# EAGLE design BMS_Slave_V2.0 (EAGLE 6.5.0)
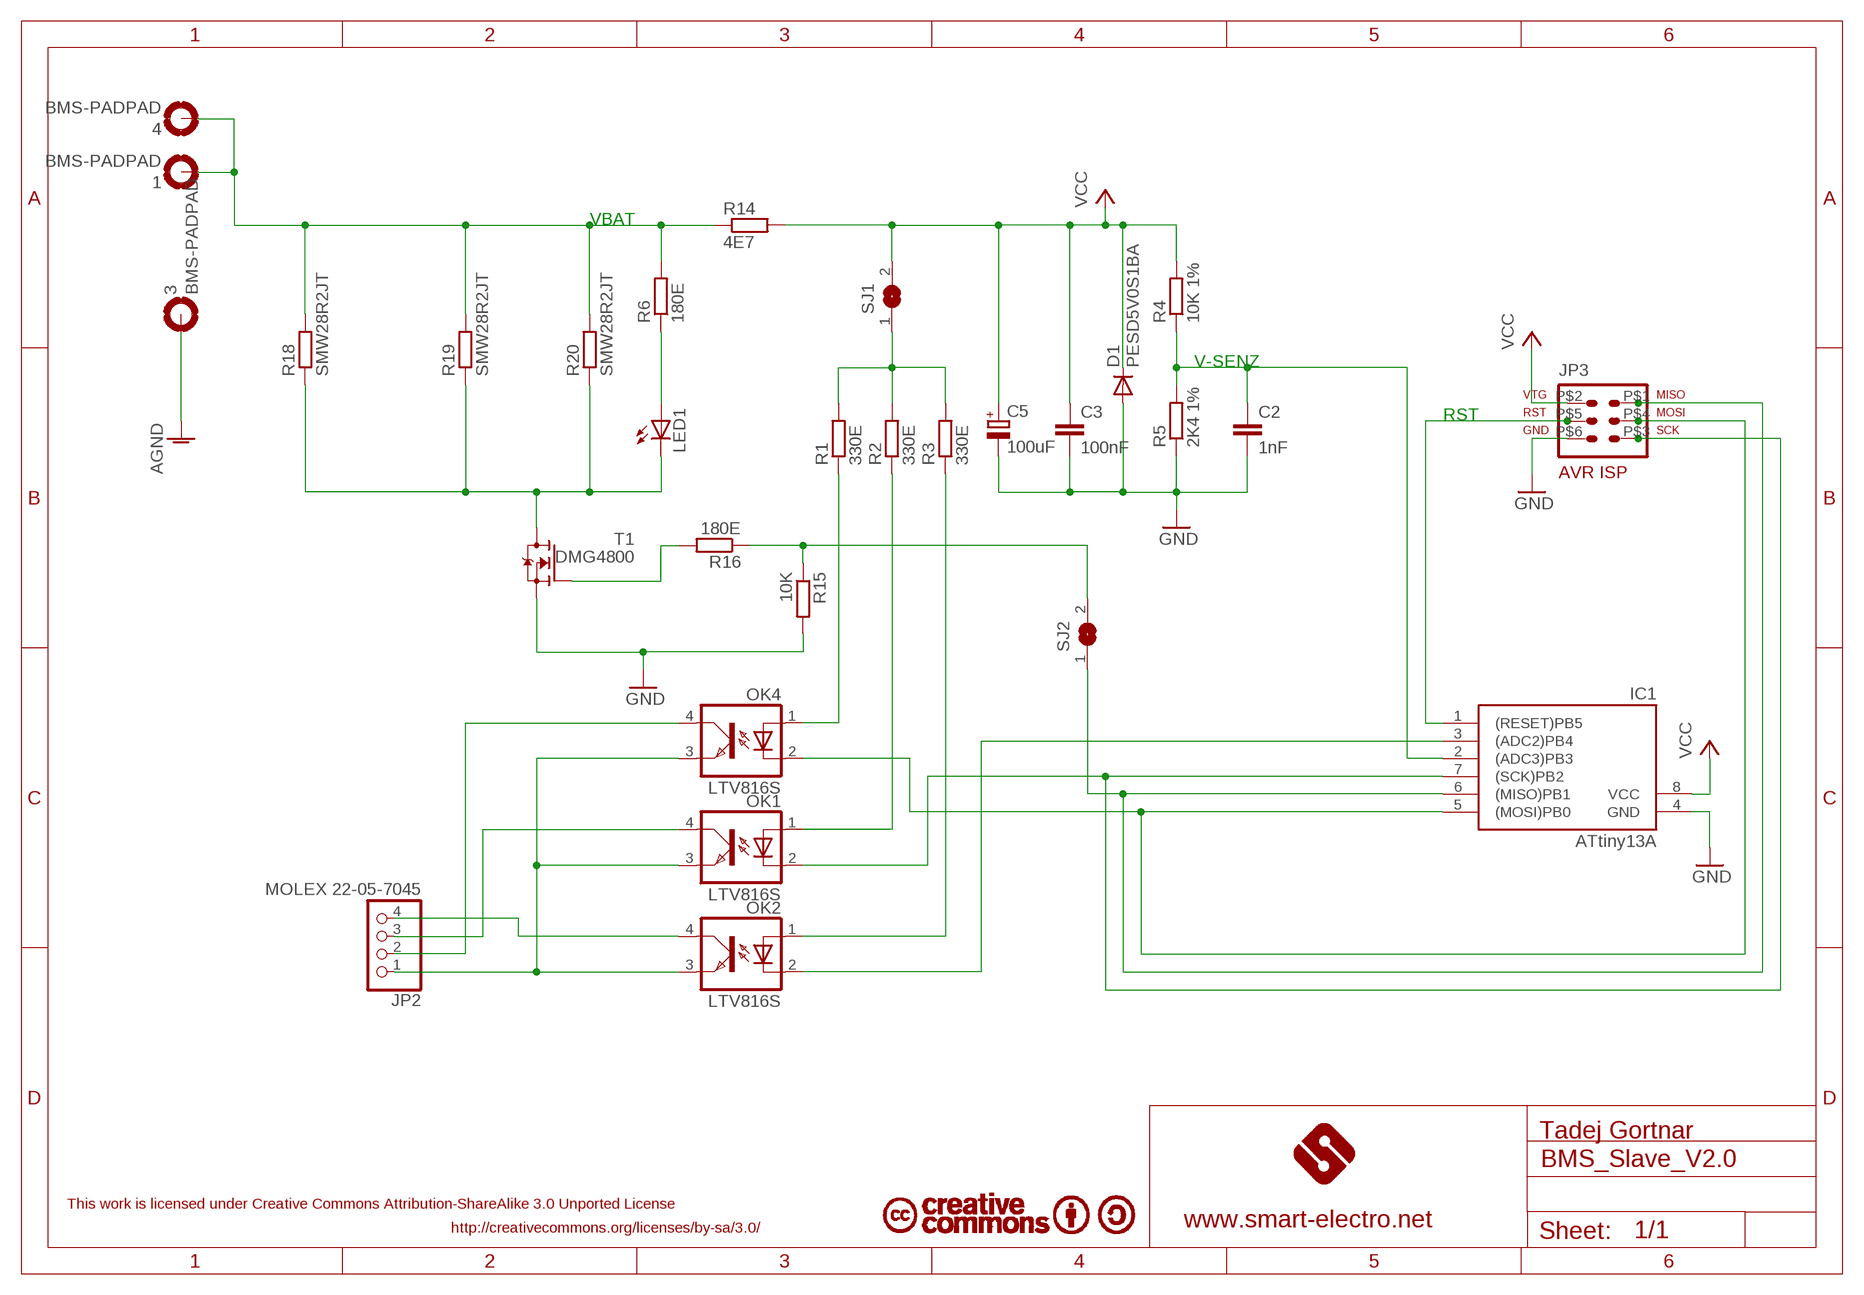
[diagram p0: schematic, sheet 1]

## Parts
1  BMS-PADPAD  [BMSPAD]
3  BMS-PADPAD  [BMSPAD]
4  BMS-PADPAD  [BMSPAD]
C2  1nF  C-EUC0805K  [C0805K]
C3  100nF  C-EUC0805K  [C0805K]
C5  100uF  CPOL-EU153CLV-0605  [153CLV-0605]
D1  PESD5V0S1BA  DIODE-SOD323-W  [SOD323-W]
IC1  ATtiny13A  TINY138S2  [SO08]
JP2  MOLEX 22-05-7045  PINHD-1X4  [1X04]
JP3  AVR-ISP-6S  [6PAD_ISP_SMD]
LED1  LEDCHIP-LED0805  [CHIP-LED0805]
OK1  LTV816S  [SMD4]
OK2  LTV816S  [SMD4]
OK4  LTV816S  [SMD4]
R1  330E  R-EU_M0805  [M0805]
R2  330E  R-EU_M0805  [M0805]
R3  330E  R-EU_M0805  [M0805]
R4  10K 1%  R-EU_M0805  [M0805]
R5  2K4 1%  R-EU_M0805  [M0805]
R6  180E  R-EU_M0805  [M0805]
R14  4E7  R-EU_M0805  [M0805]
R15  10K  R-EU_M0805  [M0805]
R16  180E  R-EU_M0805  [M0805]
R18  SMW28R2JT  R-EU_R2512W  [R2512W]
R19  SMW28R2JT  R-EU_R2512W  [R2512W]
R20  SMW28R2JT  R-EU_R2512W  [R2512W]
SJ1  SJ  [SJ]
SJ2  SJ  [SJ]
T1  DMG4800  [TO252]

## Nets
AGND: 3.B5,5(MOUNT)
GND [balancing current]: C2.2 C3.2 C5.- D1.A IC1.4(GND) JP3.P$6 R5.1 R15.2 T1.2(S)
MISO: IC1.6((MISO)PB1) JP3.P$1 SJ2.1
MOSI: IC1.5((MOSI)PB0) JP3.P$4 OK4.2(C)
N$1: JP2.2 OK4.4(COL)
N$2: JP2.3 OK1.4(COL)
N$3: JP2.4 OK2.4(COL)
N$4: R1.2 R2.2 R3.2 SJ1.1
N$5 [balancing current]: LED1.C R18.1 R19.1 R20.1 T1.3(D)
N$6: JP2.1 OK1.3(EMIT) OK2.3(EMIT) OK4.3(EMIT)
N$7: R16.2 T1.1(G)
N$8: R15.1 R16.1 SJ2.2
N$11: OK4.1(A) R1.1
N$12: OK1.1(A) R2.1
N$13: OK2.1(A) R3.1
N$25: LED1.A R6.1
N$26: IC1.3((ADC2)PB4) OK2.2(C)
RST: IC1.1((RESET)PB5) JP3.P$5
SCK: IC1.7((SCK)PB2) JP3.P$3 OK1.2(C)
V-SENZ: C2.1 IC1.2((ADC3)PB3) R4.1 R5.2
VBAT [balancing current]: 1.B5,5(MOUNT) 4.B5,5(MOUNT) R6.2 R14.1 R18.2 R19.2 R20.2
VCC: C3.1 C5.+ D1.C IC1.8(VCC) JP3.P$2 R4.2 R14.2 SJ1.2

## Notes on the sheet
- Tadej Gortnar
- This work is licensed under Creative Commons Attribution-ShareAlike 3.0 Unported License
- www.smart-electro.net
- http://creativecommons.org/licenses/by-sa/3.0/

## Library data of the parts
1 3 4 = holes:BMS-PAD
C2 C3 = rcl:C-EU: CAPACITOR, European symbol
C5 = resistor:CPOL-EU: POLARIZED CAPACITOR, European symbol
D1 = diode:DIODE-: DIODE
IC1 = avr-4:TINY13*
JP2 = pinhead_old:PINHD-1X4
JP3 = avr-4:AVR-ISP-6: AVR ISP-6 Serial Programming Header
LED1 = led:LED: LED OSRAM: - CHIPLED LG R971, LG N971, LY N971, LG Q971, LY Q971, LO R971, LY R971 LH N974, LH R974 LS Q976, LO Q976, LY Q976 LO Q996 - Hyper CHIPLED LW Q18S LB Q993, LB Q99A, LB R99A - SideLED LS A670, LO A670, LY A670, LG A670, LP A670 LB A673, LV A673, LT A673, LW A673 LH A674 LY A675 LS A676, LA A676, LO A676, LY A676, LW A676 LS A679, LY A679, LG A679 - Hyper Micro SIDELED® LS Y876, LA Y876, LO Y876, LY Y876 LT Y87S - SmartLED LW L88C, LW L88S LB L89C, LB L89S, LG L890 LS L89K, LO L89K, LY L89K LS L896, LA L896, LO L896, LY L896 - TOPLED LS T670, LO T670, LY T670, LG T670, LP T670 LSG T670, LSP T670, LSY T670, LOP T670, LYG T670 LG T671, LOG T671, LSG T671 LB T673, LV T673, LT T673, LW T673 LH T674 LS T676, LA T676, LO T676, LY T676, LB T676, LH T676, LSB T676, LW T676 LB T67C, LV T67C, LT T67C, LS T67K, LO T67K, LY T67K, LW E67C LS E67B, LA E67B, LO E67B, LY E67B, LB E67C, LV E67C, LT E67C LW T67C LS T679, LY T679, LG T679 LS T770, LO T770, LY T770, LG T770, LP T770 LB T773, LV T773, LT T773, LW T773 LH T774 LS E675, LA E675, LY E675, LS T675 LS T776, LA T776, LO T776, LY T776, LB T776 LHGB T686 LT T68C, LB T68C - Hyper Mini TOPLED® LB M676 - Mini TOPLED Santana® LG M470 LS M47K, LO M47K, LY M47K Source: http://www.osram.convergy.de LUXEON: - LUMILED® LXK2-PW12-R00, LXK2-PW12-S00, LXK2-PW14-U00, LXK2-PW14-V00 LXK2-PM12-R00, LXK2-PM12-S00, LXK2-PM14-U00 LXK2-PE12-Q00, LXK2-PE12-R00, LXK2-PE12-S00, LXK2-PE14-T00, LXK2-PE14-U00 LXK2-PB12-K00, LXK2-PB12-L00, LXK2-PB12-M00, LXK2-PB14-N00, LXK2-PB14-P00, LXK2-PB14-Q00 LXK2-PR12-L00, LXK2-PR12-M00, LXK2-PR14-Q00, LXK2-PR14-R00 LXK2-PD12-Q00, LXK2-PD12-R00, LXK2-PD12-S00 LXK2-PH12-R00, LXK2-PH12-S00 LXK2-PL12-P00, LXK2-PL12-Q00, LXK2-PL12-R00 Source: www.luxeon.com KINGBRIGHT: KA-3528ASYC Source: www.kingbright.com
OK1 OK2 OK4 = optocoupler:LTV816: OPTO COUPLER Source: LITEON, LTV816.pdf; OC_FARNELL: unknown; OC_NEWARK: unknown
R1-R6 R14-R16 = rcl:R-EU_: RESISTOR, European symbol
R18-R20 = resistor:R-EU_: RESISTOR, European symbol
SJ1 SJ2 = jumper:SJ: SMD solder JUMPER
T1 = transistor-fet:DMG4800: N-CHANNEL ENHANCEMENT MODE MOSFET

## Net classes
1 balancing current: width 1.524 mm

## Board
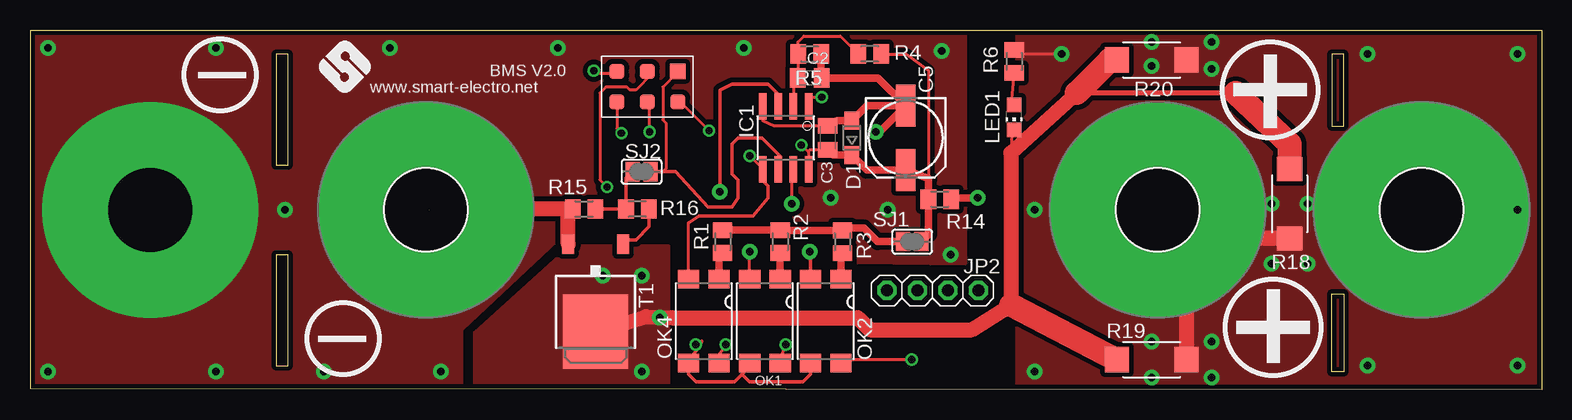
[diagram p1: board, top side]
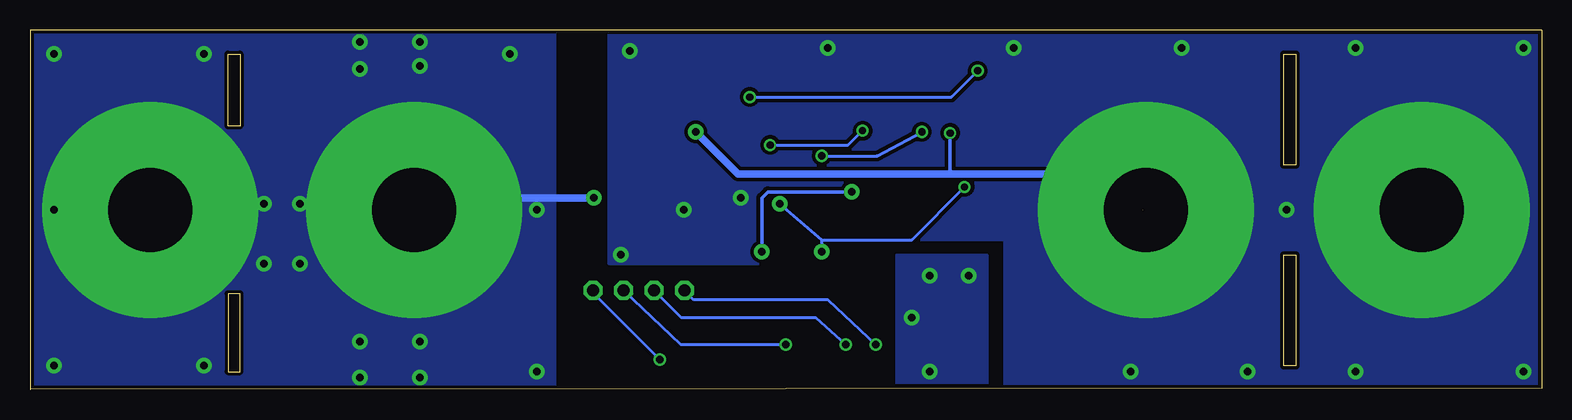
[diagram p2: board, bottom side, seen from below]

Size 126 x 30 mm. Coordinates in mm from the lower left corner, seen from the top.
Outline: 126,0.03 0,0.1 0,30 126,30 126,0.03
Outline: 126,0.03 126,0
Outline: 109.5,8 109.5,1.5 108.5,1.5 108.5,8 109.5,8
Outline: 109.5,28 108.5,28 108.5,22 109.5,22 109.5,28
Outline: 21.5,28 20.5,28 20.5,18.75 21.5,18.75 21.5,28
Outline: 21.5,11.25 20.5,11.25 20.5,2 21.5,2 21.5,11.25
Copper layers (1*16): Top 0.035mm / dielectric 1.5mm / Bottom 0.035mm
Design rules "default *": minimum track width 10mil, minimum drill 0.4mm, track to track 8mil, track to pad 8mil, pad to pad 8mil, via to via 8mil, smd to smd 8mil, copper to edge 0.002540625mm, drill to drill 8mil, minimum pad ring 10mil, minimum via ring 8mil, stop-mask expansion 4mil, vias tented up to drill 0mil, thermal gap 1mil

### Footprints (pad centres in the part's own frame; a part is rotated, then mirrored left to right if it is on the bottom)
BMSPAD = drill 7 pad 18: B5,5 0,0
C0805K = smd 1.3 x 1.6: 1 -1,0; 2 1,0
153CLV-0605 = smd 3.5 x 1.6: + 2.7,0; - -2.7,0
SOD323-W = smd 1.5 x 1.2: A 1.45,0; C -1.45,0
SO08 = smd 0.61 x 2.21: 1 -1.905,-2.616; 2 -0.635,-2.616; 3 0.635,-2.616; 4 1.905,-2.616; 5 1.905,2.616; 6 0.635,2.616; 7 -0.635,2.616; 8 -1.905,2.616
1X04 = drill 1.016 pad 1.6 octagon: 1 -3.81,0; 2 -1.27,0; 3 1.27,0; 4 3.81,0
6PAD_ISP_SMD = smd 1.27 x 1.27: P$1 2.54,0; P$2 0,0; P$3 2.54,2.54; P$4 0,2.54; P$5 2.54,5.08; P$6 0,5.08
CHIP-LED0805 = smd 1.2 x 1.2: A 0,-1.05; C 0,1.05
SMD4 = smd 1.78 x 1.55: 1 -1.27,-3.5; 2 1.27,-3.5; 3 1.27,3.5; 4 -1.27,3.5
M0805 = smd 1.3 x 1.6: 1 -0.95,0; 2 0.95,0
R2512W = smd 2 x 2.1: 1 -2.896,0; 2 2.896,0
SJ = smd 1.168 x 1.6: 1 -0.762,0; 2 0.762,0
TO252 = smd 1 x 1.6: 1 -2.28,-4.8; 2 2.28,-4.8 | smd 5.4 x 6.2: 3 0,2.5

### Placement (x,y rotation side)
1  116,15 0 top
3  33,15 0 top
4  94,15 0 top
C2  65,26 0 top
C3  66.5,21 90 top
C5  73,21 270 top
D1  68.5,21 90 top
IC1  63,21 180 top
JP2  75.25,8.27 0 top
JP3  54,24 90 top
LED1  82.04,22.71 180 top
OK1  61.26,5.71 180 top
OK2  66.33,5.71 180 top
OK4  56.17,5.71 180 top
R1  57.74,12.35 90 top
R2  62.55,12.34 90 top
R3  67.73,12.32 90 top
R4  70,28 0 top
R5  65,28 180 top
R6  82.04,27.37 90 top
R14  75.85,15.88 180 top
R15  46.19,15.07 180 top
R16  50.64,15.07 0 top
R18  105,15.5 270 top
R19  93.5,2.5 0 top
R20  93.5,27.5 0 top
SJ1  73.54,12.35 0 top
SJ2  50.98,18.18 180 top
T1  47.15,7.33 180 top

### Tracks (layer width: path | path; a pad name or v marks a point on that pad's centre or on a via)
AGND  (via drill 0.6 pad 1.27, 7 pad 18)
  other vias: 1.5,28.5 1.5,1.5 21.25,15 15.5,28.5 30,28.5 44,28.5 59.5,28.5 24.5,1.5 34.25,1.5 15.5,1.5 66.75,16 71.5,15 76,28.25 76.75,11.25 10,15
  pour Bottom (isolate 0.305, rank 2, no thermals): 0,0.25 44.75,0.25 44.75,12.5 61.25,12.5 61.25,10.5 77.75,10.5 77.75,30 0,30
  pour Top (isolate 0.4, rank 2, no thermals): 0,0.25 36,0.25 36,5 44,12.5 59.75,13.25 59.75,10.75 78,10.5 78,30 0,30
GND  (via drill 0.6 pad 1.27, 0.61)  (1 unrouted)
  Top 0.254: C3.2 62,22 61.09,22.41 IC1.4 | JP3.P$6 48.92,21.78 v49.3,21.4
  Top 0.61: C3.2 67.26,22.45 D1.A 69.75,23.7 C5.- | R5.1 65.95,26.05 C2.2 70.7,26 C5.- | v70.5,21.5 70.8,21.5 C5.-
  Top 1.27: T1.2 44.87,14.7 R15.2 36.18,15.07 36,15.25 33.5,15.25 33.25,15
  Bottom 0.305: v49.3,21.4 49.3,18.3 49,18
  Bottom 0.61: 36,18 49,18 67,18 v70.5,21.5
  Bottom 1.27: 36,18 36,17.75 33.25,15
MISO
  Top 0.254: JP3.P$1 54.3,26.4 53.9,26.4 52.75,25.25 52.75,22.5 53,22.25 53,18.43 52.75,18.18
  Top 0.305: SJ2.1 52.75,18.18 53.83,18.18 56.5,15.25 58.5,15.25 59,16 59,17.5 58.5,18 58.5,20.5 59,21 61,21 62.5,19.5 62.5,18.52 IC1.6
MOSI  (via drill 0.61)
  Top 0.254: OK4.2 54.9,13.9 | 60.98,18.5 IC1.5 60.9,18.6 v60,19.5 | v51.65,21.5 51.65,23.8 51.9,23.8 JP3.P$4
  Top 0.305: 54.9,13.9 55.75,14.5 60.25,14.5 61.5,16 61.5,17 61,17.5 61,18.29 IC1.5
  Bottom 0.254: v51.65,21.5 55.4,19.5 v60,19.5
N$1  (via drill 0.6)
  Top 0.254: OK4.4 57.44,2.94 v58,3.75
  Bottom 0.254: v58,3.75 60.5,6 71.71,6 JP2.2
N$2  (via drill 0.6)
  Top 0.254: 62.53,2.55 62.55,2.55 v63,3.75
  Top 0.305: OK1.4 62.53,2.55
  Bottom 0.254: v63,3.75 71.75,3.75 JP2.3
N$3  (via drill 0.6)
  Top 0.254: v73.5,2.5 67.9,2.5 OK2.4
  Bottom 0.254: JP2.4 79.06,8.06 v73.5,2.5
N$4
  Top 0.61: SJ1.1 70.65,12.35 69.5,13.5 67.95,13.5 R3.2 62.57,13.27 R2.2 R1.2
N$5  (via drill 0.6 pad 1.27)
  Top 0.254: LED1.C 81.84,21.41 81.75,19.75
  Top 0.406: 100.5,24.75 87.25,24.75 87,24.75
  Top 1.27: R20.1 90,27.5 | 87.25,24.75 81.75,19.75 81.75,6.85 81.8,7.05 78.5,5 70,5 69,6 53.5,6 51.33,6.08 T1.3
  Top 2: 90,27.5 87.25,24.75 | 81.8,7.05 R19.1 | R18.1 105,20.5 100.5,24.75
  other vias: 51,1.5 51,9.5 47.75,9.5 52.5,6
  pour Top (isolate 0.4, no thermals): 53.25,0.25 53.25,12 45,12 37,4.75 37,0.25
  pour Bottom (isolate 0.4, no thermals): 46.25,0.25 53.75,0.25 53.75,11.25 46.25,11.25
N$6  (via drill 0.6)
  Top 0.254: v55.5,3.75 56,4.07 OK4.3
  Top 0.305: 59.34,1.27 58.71,0.64 55.53,0.64 54.9,1.27 OK4.3 | OK1.3 59.36,1.28 59.34,1.27 | 59.34,1.27 59.98,0.64 64.42,0.64 65.06,1.27 OK2.3
  Bottom 0.254: v55.5,3.75 59.5,7.5 70.67,7.5 JP2.1
N$7
  Top 0.305: R16.2 51.59,13.59 50.5,12.5 49.8,12.5 T1.1
N$8
  Top 0.305: R15.1 R16.1 49.69,17.64 SJ2.2
N$11
  Top 0.61: OK4.1 57.44,11.09 R1.1
N$12
  Top 0.61: OK1.1 62.53,11.38 R2.1
N$13
  Top 0.61: OK2.1 67.6,11.25 R3.1
N$25
  Top 0.254: R6.1 81.79,23.76 LED1.A
N$26  (via drill 0.6 pad 1.27)
  Top 0.254: IC1.3 62.5,23.75 62.5,24.5
  Top 0.305: OK2.2 65.06,11.44 v65,11.5 | v57.5,16.5 57.5,25 58.5,25.5 61.5,25.5 62.5,24.5
  Bottom 0.305: v65,11.5 65,16 64.5,16.5 v57.5,16.5
RST  (via drill 0.61)
  Top 0.254: v47,26.6 47.5,26.4 49.3,26.4 JP3.P$5 | v66,24.4 65,24.4 65,23.7 IC1.1
  Bottom 0.254: v66,24.4 49.2,24.4 v47,26.6
SCK  (via drill 0.6 pad 1.27, 0.61)
  Top 0.254: OK1.2 v59.99,11.49 v60,11.5 | v63.5,15.5 63.5,18.25 IC1.7 | JP3.P$3 51.8,26.5 51.8,26.3 50.5,25 50,25 49.75,25.25 48,25.25 47.5,24.75 47.5,17.5 v48.1,16.9
  Bottom 0.254: v60,11.5 60,12.5 | 60,12.5 v63.5,15.5 | v48.1,16.9 52.5,12.5 60,12.5
V-SENZ
  Top 0.254: IC1.2 63.64,25.64 C2.1 64.05,26.05 R5.2 64,28.05 64,29 64.5,29.5 67.55,29.5 R4.1
VBAT  (via drill 0.6 pad 1.27)
  Top 0.254: v86,28 82.11,28 R6.2
  Top 0.61: 76.92,16 v79,16
  Top 1.27: 4.B5,5 96.4,15 | 96.4,15 R19.2 | 76.92,16 R14.1 | R18.2 98.79,12.6 96.4,15
  Bottom 0.61: v79,16 93,16 4.B5,5
  other vias: 83.75,1.5 98.5,1 111.5,2 124,2 124,15 124,28 111.5,28 98.5,29 93.5,29 93.5,4 93.5,1 98.5,4 98.5,26.75 103.5,15.5 106.5,15.5 103.5,10.5 106.5,10.5 93.5,27 83.75,15
  pour Top (isolate 0.4, no thermals): 82.25,30 126,30 126,0 82.25,0
  pour Bottom (isolate 0.3, no thermals): 126,0 82.25,-0.25 82.25,29.75 126,30
VCC  (via drill 0.61)
  Top 0.254: C3.1 65,20 64.91,19.91 64.91,19.9 | 64.91,19.9 IC1.8 | R4.2 73,28 74.9,26.6 74.9,17.5 | v56.6,21.6 54.4,23.8 JP3.P$2 | v64.3,20.4 64.8,19.9 64.91,19.9
  Top 0.61: SJ1.2 74.9,12.94 R14.2 74.9,17.5 74.9,17.61 C5.+ 69.75,18.3 D1.C 66.98,19.55 C3.1
  Bottom 0.254: v56.6,21.6 57.8,20.4 v64.3,20.4

### Text on the board
tNames: BMS V2.0 | www.smart-electro.net